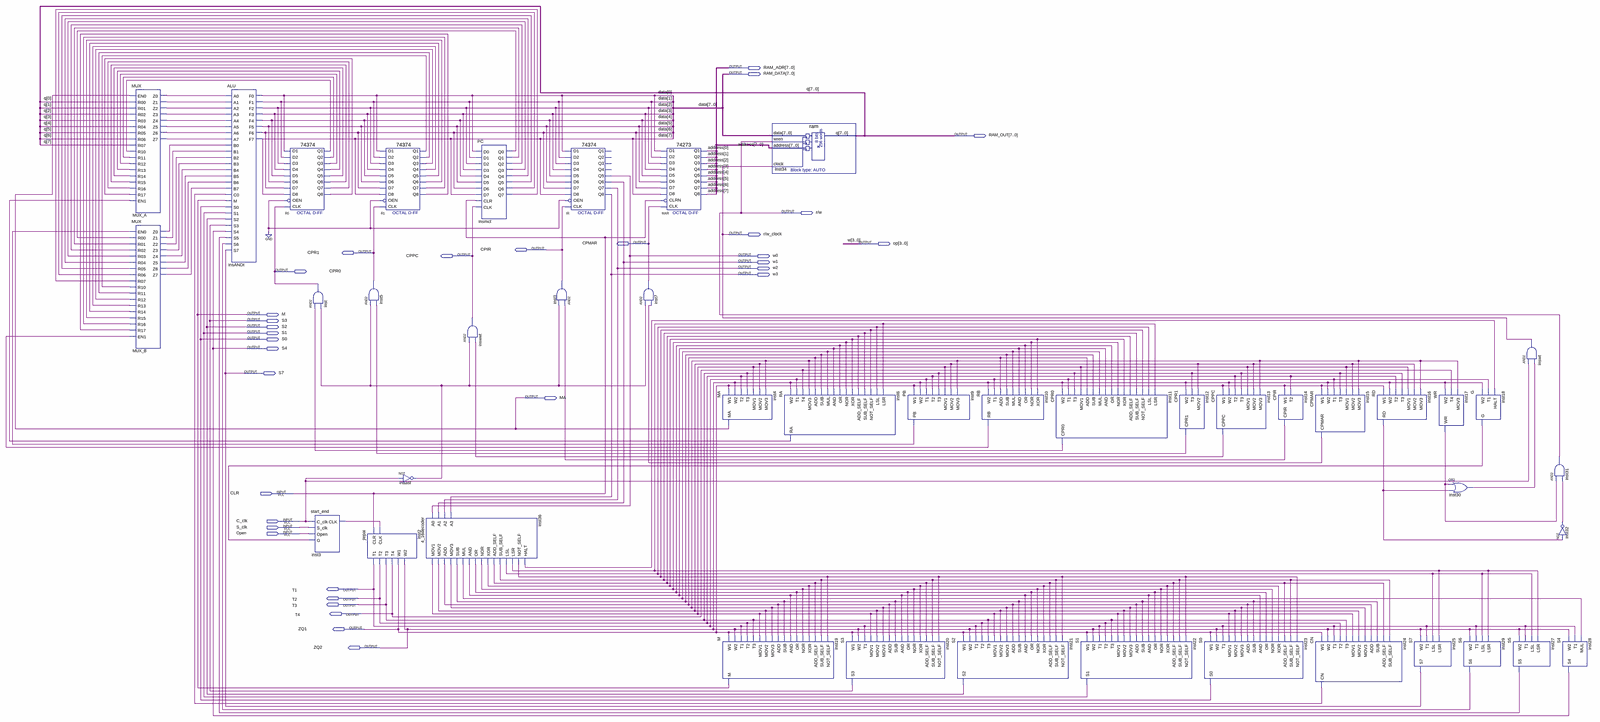
[diagram p0: schematic sheet, whole]
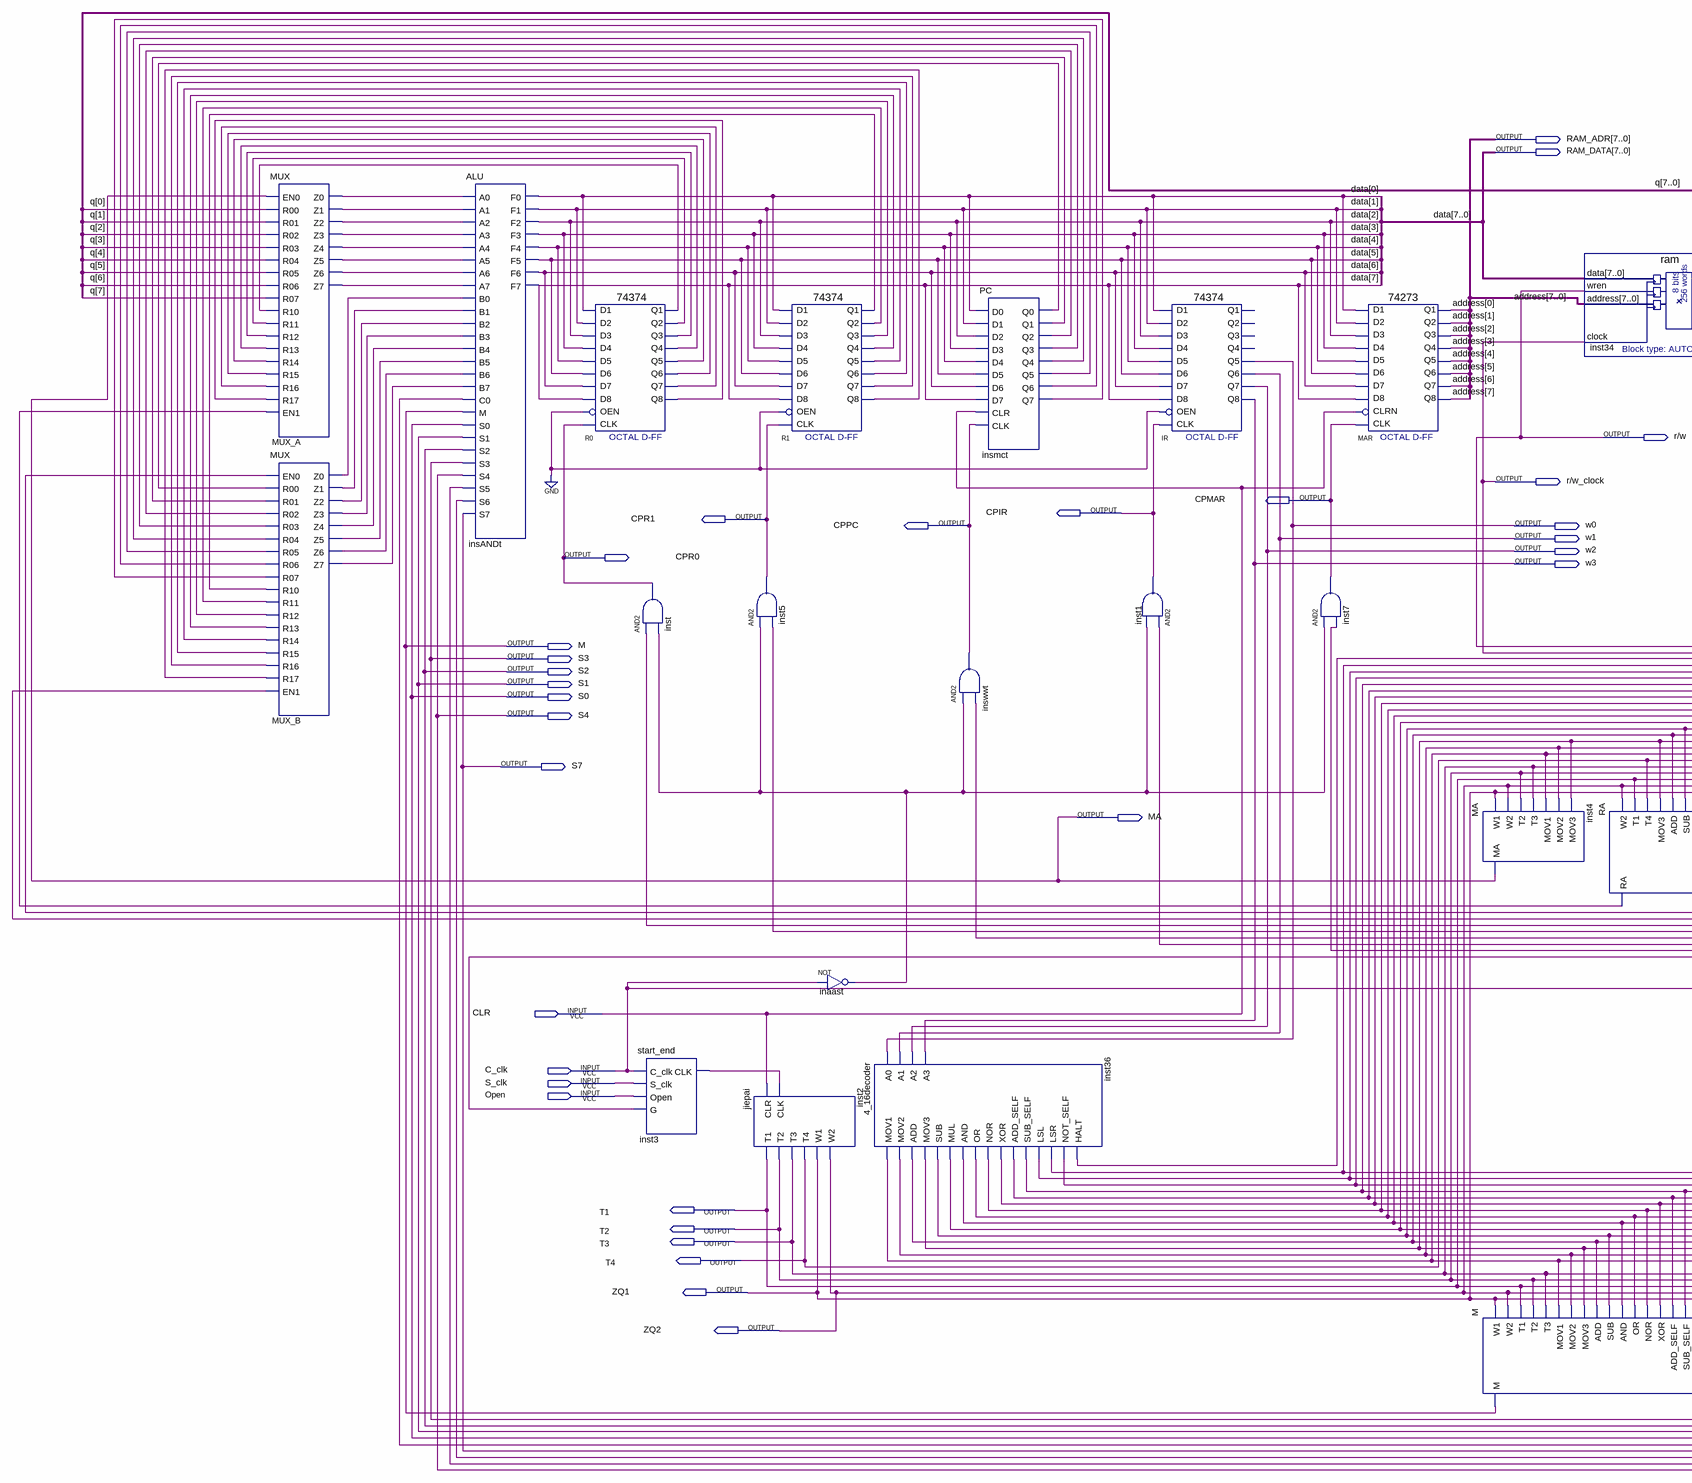
[diagram p1: schematic sheet, left part]
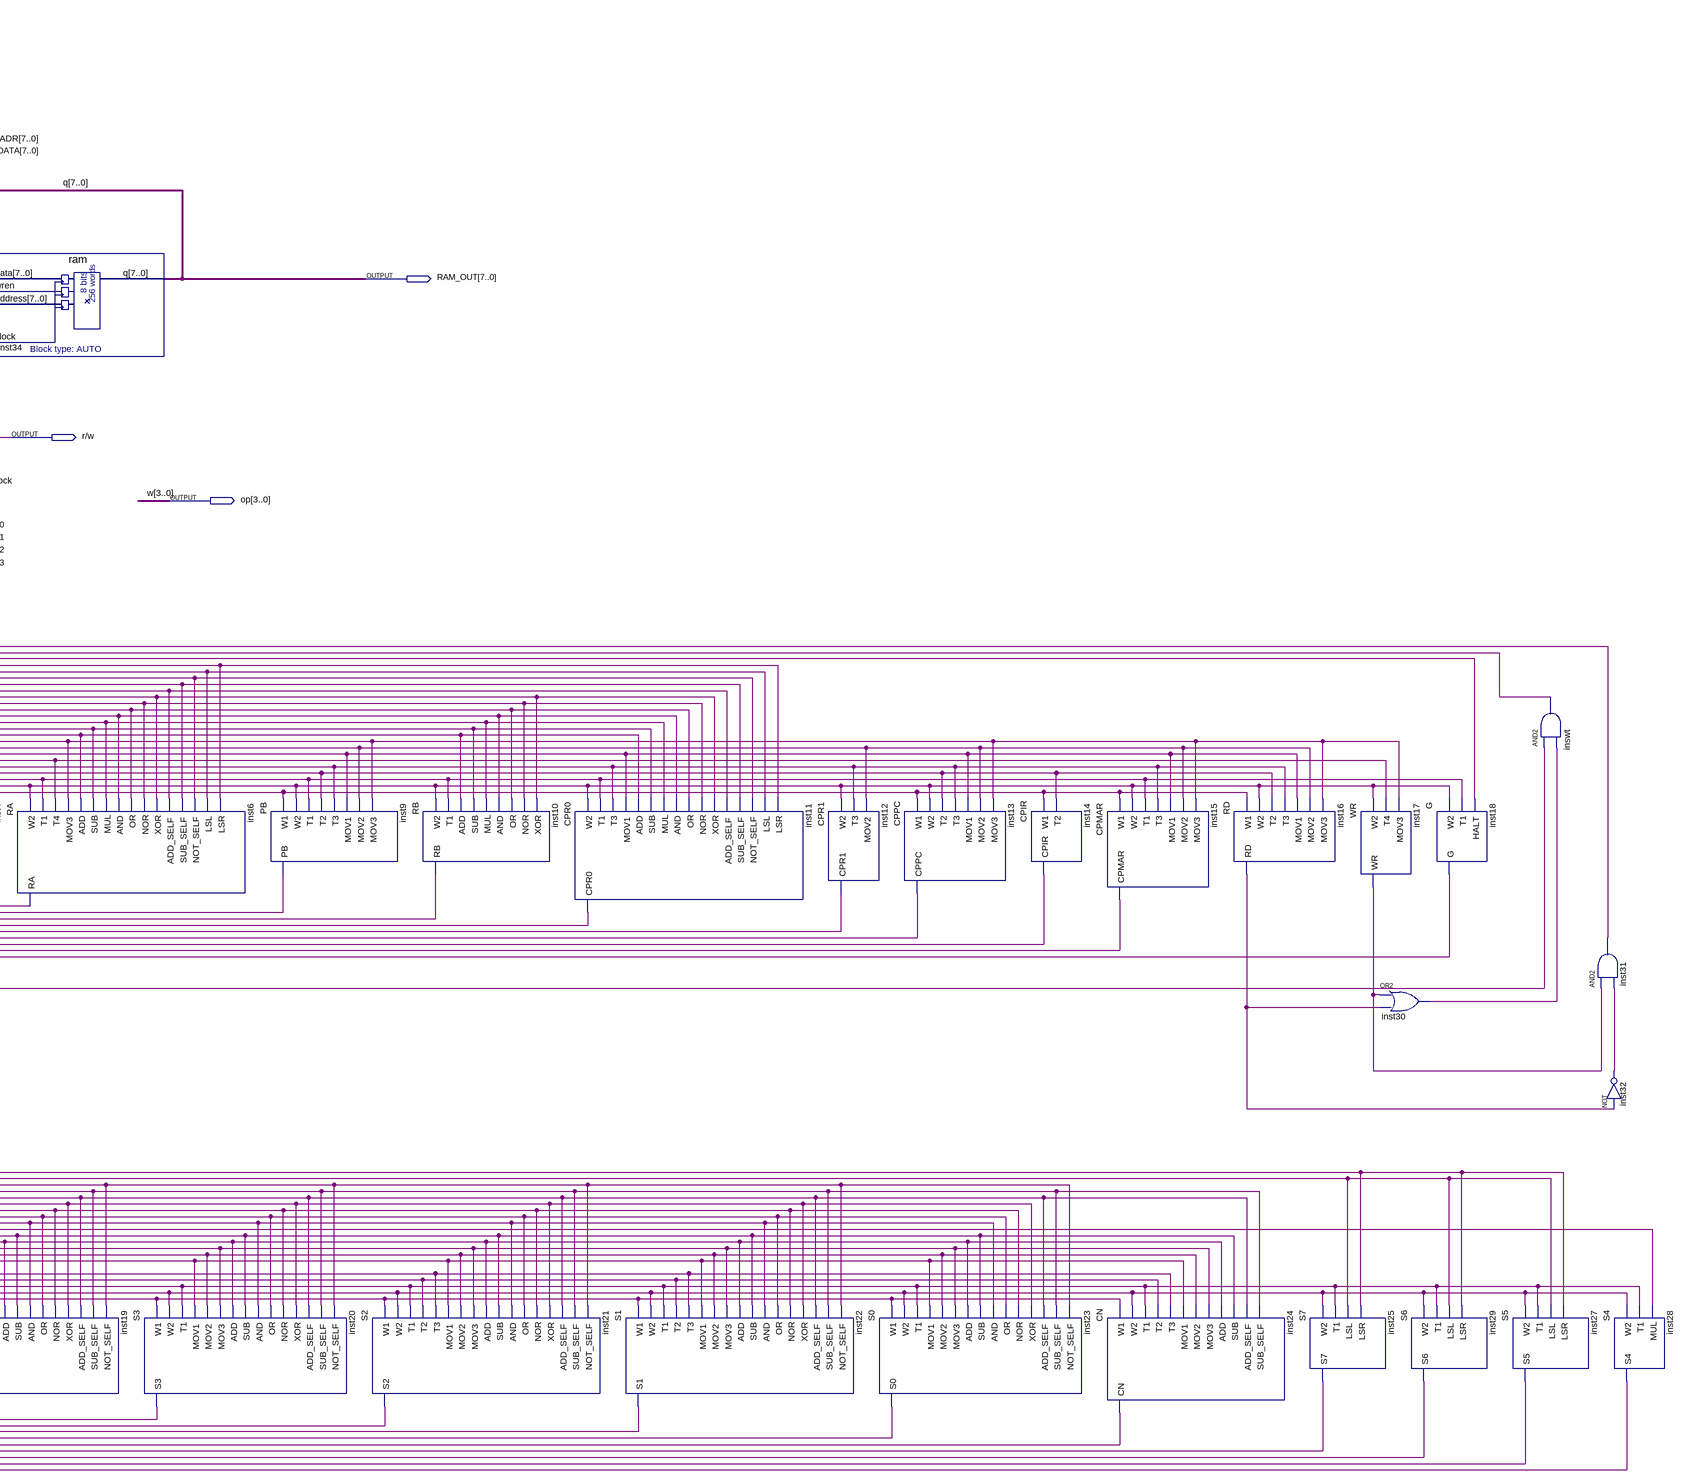
[diagram p2: schematic sheet, right part]
// Quartus schematic test4.bdf as structural Verilog: 44 symbols, 33 pins
module test4 (
  input  CLR,
  input  C_clk,
  input  S_clk,
  input  Open,
  output [7:0] RAM_ADR,
  output [7:0] RAM_DATA,
  output [7:0] RAM_OUT,
  output \r/w ,
  output \r/w_clock ,
  output CPMAR,
  output [3:0] op,
  output CPIR,
  output CPR1,
  output CPPC,
  output w0,
  output w1,
  output w2,
  output CPR0,
  output w3,
  output M,
  output S3,
  output S2,
  output S1,
  output S0,
  output S4,
  output S7,
  output MA,
  output T1,
  output T2,
  output T3,
  output T4,
  output ZQ1,
  output ZQ2
);

  wire inaast_out, insmct_q0, insmct_q1, insmct_q2, insmct_q3, insmct_q4, insmct_q5, insmct_q6, insmct_q7,
       inst3_clk, inst6_ra, inst9_pb, inst10_rb, inst11_cpr0, inst12_cpr1, inst13_cppc, inst14_cpir,
       inst15_cpmar, inst16_rd, inst17_wr, inst18_g, inst24_cn, inst27_s5, inst29_s6, inst30_out, inst32_out,
       inst36_add, inst36_add_self, inst36_and, inst36_halt, inst36_lsl, inst36_lsr, inst36_mov1,
       inst36_mov2, inst36_mov3, inst36_mul, inst36_nor, inst36_not_self, inst36_or, inst36_sub,
       inst36_sub_self, inst36_xor, MUX_A_z0, MUX_A_z1, MUX_A_z2, MUX_A_z3, MUX_A_z4, MUX_A_z5, MUX_A_z6,
       MUX_A_z7, MUX_B_z0, MUX_B_z1, MUX_B_z2, MUX_B_z3, MUX_B_z4, MUX_B_z5, MUX_B_z6, MUX_B_z7, R0_q1,
       R0_q2, R0_q3, R0_q4, R0_q5, R0_q6, R0_q7, R0_q8, R1_q1, R1_q2, R1_q3, R1_q4, R1_q5, R1_q6, R1_q7,
       R1_q8;

  MUX MUX_A (
    .EN0(MA), .R00(RAM_OUT[0]), .R01(RAM_OUT[1]), .R02(RAM_OUT[2]), .R03(RAM_OUT[3]), .R04(RAM_OUT[4]),
    .R05(RAM_OUT[5]), .R06(RAM_OUT[6]), .R07(RAM_OUT[7]), .R10(R0_q1), .R11(R0_q2), .R12(R0_q3), .R13(R0_q4),
    .R14(R0_q5), .R15(R0_q6), .R16(R0_q7), .R17(R0_q8), .EN1(inst6_ra), .Z0(MUX_A_z0), .Z1(MUX_A_z1),
    .Z2(MUX_A_z2), .Z3(MUX_A_z3), .Z4(MUX_A_z4), .Z5(MUX_A_z5), .Z6(MUX_A_z6), .Z7(MUX_A_z7));
  MUX MUX_B (
    .EN0(inst9_pb), .R00(insmct_q0), .R01(insmct_q1), .R02(insmct_q2), .R03(insmct_q3), .R04(insmct_q4),
    .R05(insmct_q5), .R06(insmct_q6), .R07(insmct_q7), .R10(R1_q1), .R11(R1_q2), .R12(R1_q3), .R13(R1_q4),
    .R14(R1_q5), .R15(R1_q6), .R16(R1_q7), .R17(R1_q8), .EN1(inst10_rb), .Z0(MUX_B_z0), .Z1(MUX_B_z1),
    .Z2(MUX_B_z2), .Z3(MUX_B_z3), .Z4(MUX_B_z4), .Z5(MUX_B_z5), .Z6(MUX_B_z6), .Z7(MUX_B_z7));
  ALU insANDt (
    .A0(MUX_A_z0), .A1(MUX_A_z1), .A2(MUX_A_z2), .A3(MUX_A_z3), .A4(MUX_A_z4), .A5(MUX_A_z5), .A6(MUX_A_z6),
    .A7(MUX_A_z7), .B0(MUX_B_z0), .B1(MUX_B_z1), .B2(MUX_B_z2), .B3(MUX_B_z3), .B4(MUX_B_z4), .B5(MUX_B_z5),
    .B6(MUX_B_z6), .B7(MUX_B_z7), .C0(inst24_cn), .M(M), .S0(S0), .S1(S1), .S2(S2), .S3(S3), .S4(S4),
    .S5(inst27_s5), .S6(inst29_s6), .S7(S7), .F0(RAM_DATA[0]), .F1(RAM_DATA[1]), .F2(RAM_DATA[2]),
    .F3(RAM_DATA[3]), .F4(RAM_DATA[4]), .F5(RAM_DATA[5]), .F6(RAM_DATA[6]), .F7(RAM_DATA[7]));
  \74374  R0 (
    .D1(RAM_DATA[0]), .D2(RAM_DATA[1]), .D3(RAM_DATA[2]), .D4(RAM_DATA[3]), .D6(RAM_DATA[5]),
    .D5(RAM_DATA[4]), .OEN(1'b0), .D8(RAM_DATA[7]), .D7(RAM_DATA[6]), .CLK(CPR0), .Q2(R0_q2), .Q3(R0_q3),
    .Q5(R0_q5), .Q4(R0_q4), .Q6(R0_q6), .Q7(R0_q7), .Q8(R0_q8), .Q1(R0_q1));
  and inst (CPR0, inst11_cpr0, inaast_out);
  start_end inst3 (.C_clk(C_clk), .S_clk(S_clk), .Open(Open), .G(inst18_g), .CLK(inst3_clk));
  and inst5 (CPR1, inaast_out, inst12_cpr1);
  jiepai inst2 (.CLR(CLR), .CLK(inst3_clk), .T1(T1), .T2(T2), .T3(T3), .T4(T4), .W1(ZQ1), .W2(ZQ2));
  \74374  R1 (
    .D1(RAM_DATA[0]), .D2(RAM_DATA[1]), .D3(RAM_DATA[2]), .D4(RAM_DATA[3]), .D6(RAM_DATA[5]),
    .D5(RAM_DATA[4]), .OEN(1'b0), .D8(RAM_DATA[7]), .D7(RAM_DATA[6]), .CLK(CPR1), .Q2(R1_q2), .Q3(R1_q3),
    .Q5(R1_q5), .Q4(R1_q4), .Q6(R1_q6), .Q7(R1_q7), .Q8(R1_q8), .Q1(R1_q1));
  not inaast (inaast_out, C_clk);
  \4_16decoder  inst36 (
    .A0(op[0]), .A1(op[1]), .A2(op[2]), .A3(op[3]), .MOV1(inst36_mov1), .MOV2(inst36_mov2), .ADD(inst36_add),
    .MOV3(inst36_mov3), .SUB(inst36_sub), .MUL(inst36_mul), .AND(inst36_and), .OR(inst36_or),
    .NOR(inst36_nor), .XOR(inst36_xor), .ADD_SELF(inst36_add_self), .SUB_SELF(inst36_sub_self),
    .LSL(inst36_lsl), .LSR(inst36_lsr), .NOT_SELF(inst36_not_self), .HALT(inst36_halt));
  and inswwt (CPPC, inaast_out, inst13_cppc);
  PC insmct (
    .D0(RAM_DATA[0]), .D1(RAM_DATA[1]), .D2(RAM_DATA[2]), .D3(RAM_DATA[3]), .D4(RAM_DATA[4]),
    .D5(RAM_DATA[5]), .D6(RAM_DATA[6]), .D7(RAM_DATA[7]), .CLR(CLR), .CLK(CPPC), .Q0(insmct_q0),
    .Q1(insmct_q1), .Q2(insmct_q2), .Q3(insmct_q3), .Q4(insmct_q4), .Q5(insmct_q5), .Q6(insmct_q6),
    .Q7(insmct_q7));
  \74374  IR (
    .D1(RAM_DATA[0]), .D2(RAM_DATA[1]), .D3(RAM_DATA[2]), .D4(RAM_DATA[3]), .D6(RAM_DATA[5]),
    .D5(RAM_DATA[4]), .OEN(1'b0), .D8(RAM_DATA[7]), .D7(RAM_DATA[6]), .CLK(CPIR), .Q5(op[0]), .Q6(op[1]),
    .Q7(op[2]), .Q8(op[3]));  // open: Q2, Q3, Q4, Q1
  and inst1 (CPIR, inst14_cpir, inaast_out);
  and inst7 (CPMAR, inaast_out, inst15_cpmar);
  \74273  MAR (
    .D2(RAM_DATA[1]), .D3(RAM_DATA[2]), .D1(RAM_DATA[0]), .D4(RAM_DATA[3]), .D7(RAM_DATA[6]),
    .D6(RAM_DATA[5]), .D5(RAM_DATA[4]), .D8(RAM_DATA[7]), .CLK(CPMAR), .CLRN(CLR), .Q4(RAM_ADR[3]),
    .Q1(RAM_ADR[0]), .Q2(RAM_ADR[1]), .Q3(RAM_ADR[2]), .Q6(RAM_ADR[5]), .Q5(RAM_ADR[4]), .Q7(RAM_ADR[6]),
    .Q8(RAM_ADR[7]));
  MA inst4 (.W1(ZQ1), .W2(ZQ2), .T2(T2), .T3(T3), .MOV1(inst36_mov1), .MOV2(inst36_mov2), .MOV3(inst36_mov3), .MA(MA));
  M inst19 (
    .W1(ZQ1), .W2(ZQ2), .T1(T1), .T2(T2), .T3(T3), .MOV1(inst36_mov1), .MOV2(inst36_mov2),
    .MOV3(inst36_mov3), .ADD(inst36_add), .SUB(inst36_sub), .AND(inst36_and), .OR(inst36_or),
    .NOR(inst36_nor), .XOR(inst36_xor), .ADD_SELF(inst36_add_self), .SUB_SELF(inst36_sub_self),
    .NOT_SELF(inst36_not_self), .M(M));
  ram inst34 (.data(RAM_DATA), .wren(\r/w ), .address(RAM_ADR), .clock(\r/w_clock ), .q(RAM_OUT));
  RA inst6 (
    .W2(ZQ2), .T1(T1), .T4(T4), .MOV3(inst36_mov3), .ADD(inst36_add), .SUB(inst36_sub), .MUL(inst36_mul),
    .AND(inst36_and), .OR(inst36_or), .NOR(inst36_nor), .XOR(inst36_xor), .ADD_SELF(inst36_add_self),
    .SUB_SELF(inst36_sub_self), .NOT_SELF(inst36_not_self), .LSL(inst36_lsl), .LSR(inst36_lsr), .RA(inst6_ra));
  S3 inst20 (
    .W1(ZQ1), .W2(ZQ2), .T1(T1), .MOV1(inst36_mov1), .MOV2(inst36_mov2), .MOV3(inst36_mov3),
    .ADD(inst36_add), .SUB(inst36_sub), .AND(inst36_and), .OR(inst36_or), .NOR(inst36_nor), .XOR(inst36_xor),
    .ADD_SELF(inst36_add_self), .SUB_SELF(inst36_sub_self), .NOT_SELF(inst36_not_self), .S3(S3));
  PB inst9 (
    .W1(ZQ1), .W2(ZQ2), .T1(T1), .T2(T2), .T3(T3), .MOV1(inst36_mov1), .MOV2(inst36_mov2),
    .MOV3(inst36_mov3), .PB(inst9_pb));
  S2 inst21 (
    .W1(ZQ1), .W2(ZQ2), .T1(T1), .T2(T2), .T3(T3), .MOV1(inst36_mov1), .MOV2(inst36_mov2),
    .MOV3(inst36_mov3), .ADD(inst36_add), .SUB(inst36_sub), .AND(inst36_and), .OR(inst36_or),
    .NOR(inst36_nor), .XOR(inst36_xor), .ADD_SELF(inst36_add_self), .SUB_SELF(inst36_sub_self),
    .NOT_SELF(inst36_not_self), .S2(S2));
  RB inst10 (
    .W2(ZQ2), .T1(T1), .ADD(inst36_add), .SUB(inst36_sub), .MUL(inst36_mul), .AND(inst36_and),
    .OR(inst36_or), .NOR(inst36_nor), .XOR(inst36_xor), .RB(inst10_rb));
  CPR0 inst11 (
    .W2(ZQ2), .T1(T1), .T3(T3), .MOV1(inst36_mov1), .ADD(inst36_add), .SUB(inst36_sub), .MUL(inst36_mul),
    .AND(inst36_and), .OR(inst36_or), .NOR(inst36_nor), .XOR(inst36_xor), .ADD_SELF(inst36_add_self),
    .SUB_SELF(inst36_sub_self), .NOT_SELF(inst36_not_self), .LSL(inst36_lsl), .LSR(inst36_lsr),
    .CPR0(inst11_cpr0));
  S1 inst22 (
    .W1(ZQ1), .W2(ZQ2), .T1(T1), .T2(T2), .T3(T3), .MOV1(inst36_mov1), .MOV2(inst36_mov2),
    .MOV3(inst36_mov3), .ADD(inst36_add), .SUB(inst36_sub), .AND(inst36_and), .OR(inst36_or),
    .NOR(inst36_nor), .XOR(inst36_xor), .ADD_SELF(inst36_add_self), .SUB_SELF(inst36_sub_self),
    .NOT_SELF(inst36_not_self), .S1(S1));
  CPR1 inst12 (.W2(ZQ2), .T3(T3), .MOV2(inst36_mov2), .CPR1(inst12_cpr1));
  CPPC inst13 (
    .W1(ZQ1), .W2(ZQ2), .T2(T2), .T3(T3), .MOV1(inst36_mov1), .MOV2(inst36_mov2), .MOV3(inst36_mov3),
    .CPPC(inst13_cppc));
  S0 inst23 (
    .W1(ZQ1), .W2(ZQ2), .T1(T1), .MOV1(inst36_mov1), .MOV2(inst36_mov2), .MOV3(inst36_mov3),
    .ADD(inst36_add), .SUB(inst36_sub), .AND(inst36_and), .OR(inst36_or), .NOR(inst36_nor), .XOR(inst36_xor),
    .ADD_SELF(inst36_add_self), .SUB_SELF(inst36_sub_self), .NOT_SELF(inst36_not_self), .S0(S0));
  CPIR inst14 (.W1(ZQ1), .T2(T2), .CPIR(inst14_cpir));
  CPMAR inst15 (
    .W1(ZQ1), .W2(ZQ2), .T1(T1), .T3(T3), .MOV1(inst36_mov1), .MOV2(inst36_mov2), .MOV3(inst36_mov3),
    .CPMAR(inst15_cpmar));
  CN inst24 (
    .W1(ZQ1), .W2(ZQ2), .T1(T1), .T2(T2), .T3(T3), .MOV1(inst36_mov1), .MOV2(inst36_mov2),
    .MOV3(inst36_mov3), .ADD(inst36_add), .SUB(inst36_sub), .ADD_SELF(inst36_add_self),
    .SUB_SELF(inst36_sub_self), .CN(inst24_cn));
  RD inst16 (
    .W1(ZQ1), .W2(ZQ2), .T2(T2), .T3(T3), .MOV1(inst36_mov1), .MOV2(inst36_mov2), .MOV3(inst36_mov3),
    .RD(inst16_rd));
  S7 inst25 (.W2(ZQ2), .T1(T1), .LSL(inst36_lsl), .LSR(inst36_lsr), .S7(S7));
  WR inst17 (.W2(ZQ2), .T4(T4), .MOV3(inst36_mov3), .WR(inst17_wr));
  or inst30 (inst30_out, inst17_wr, inst16_rd);
  S6 inst29 (.W2(ZQ2), .T1(T1), .LSL(inst36_lsl), .LSR(inst36_lsr), .S6(inst29_s6));
  G inst18 (.W2(ZQ2), .T1(T1), .HALT(inst36_halt), .G(inst18_g));
  S5 inst27 (.W2(ZQ2), .T1(T1), .LSL(inst36_lsl), .LSR(inst36_lsr), .S5(inst27_s5));
  and inswt (\r/w_clock , C_clk, inst30_out);
  and inst31 (\r/w , inst17_wr, inst32_out);
  not inst32 (inst32_out, inst16_rd);
  S4 inst28 (.W2(ZQ2), .T1(T1), .MUL(inst36_mul), .S4(S4));

  assign w0 = op[0];
  assign w1 = op[1];
  assign w2 = op[2];
  assign w3 = op[3];

  // Other names for the same wires on the sheet: address[7:0] = RAM_ADR; data[7:0] = RAM_DATA; q[7:0] = RAM_OUT;
  //   w[3:0] = op
endmodule
